# Altium schematic sheet PLWD_harvesting.SchDoc
size B; SheetNumber: 10; SheetTotal: 11
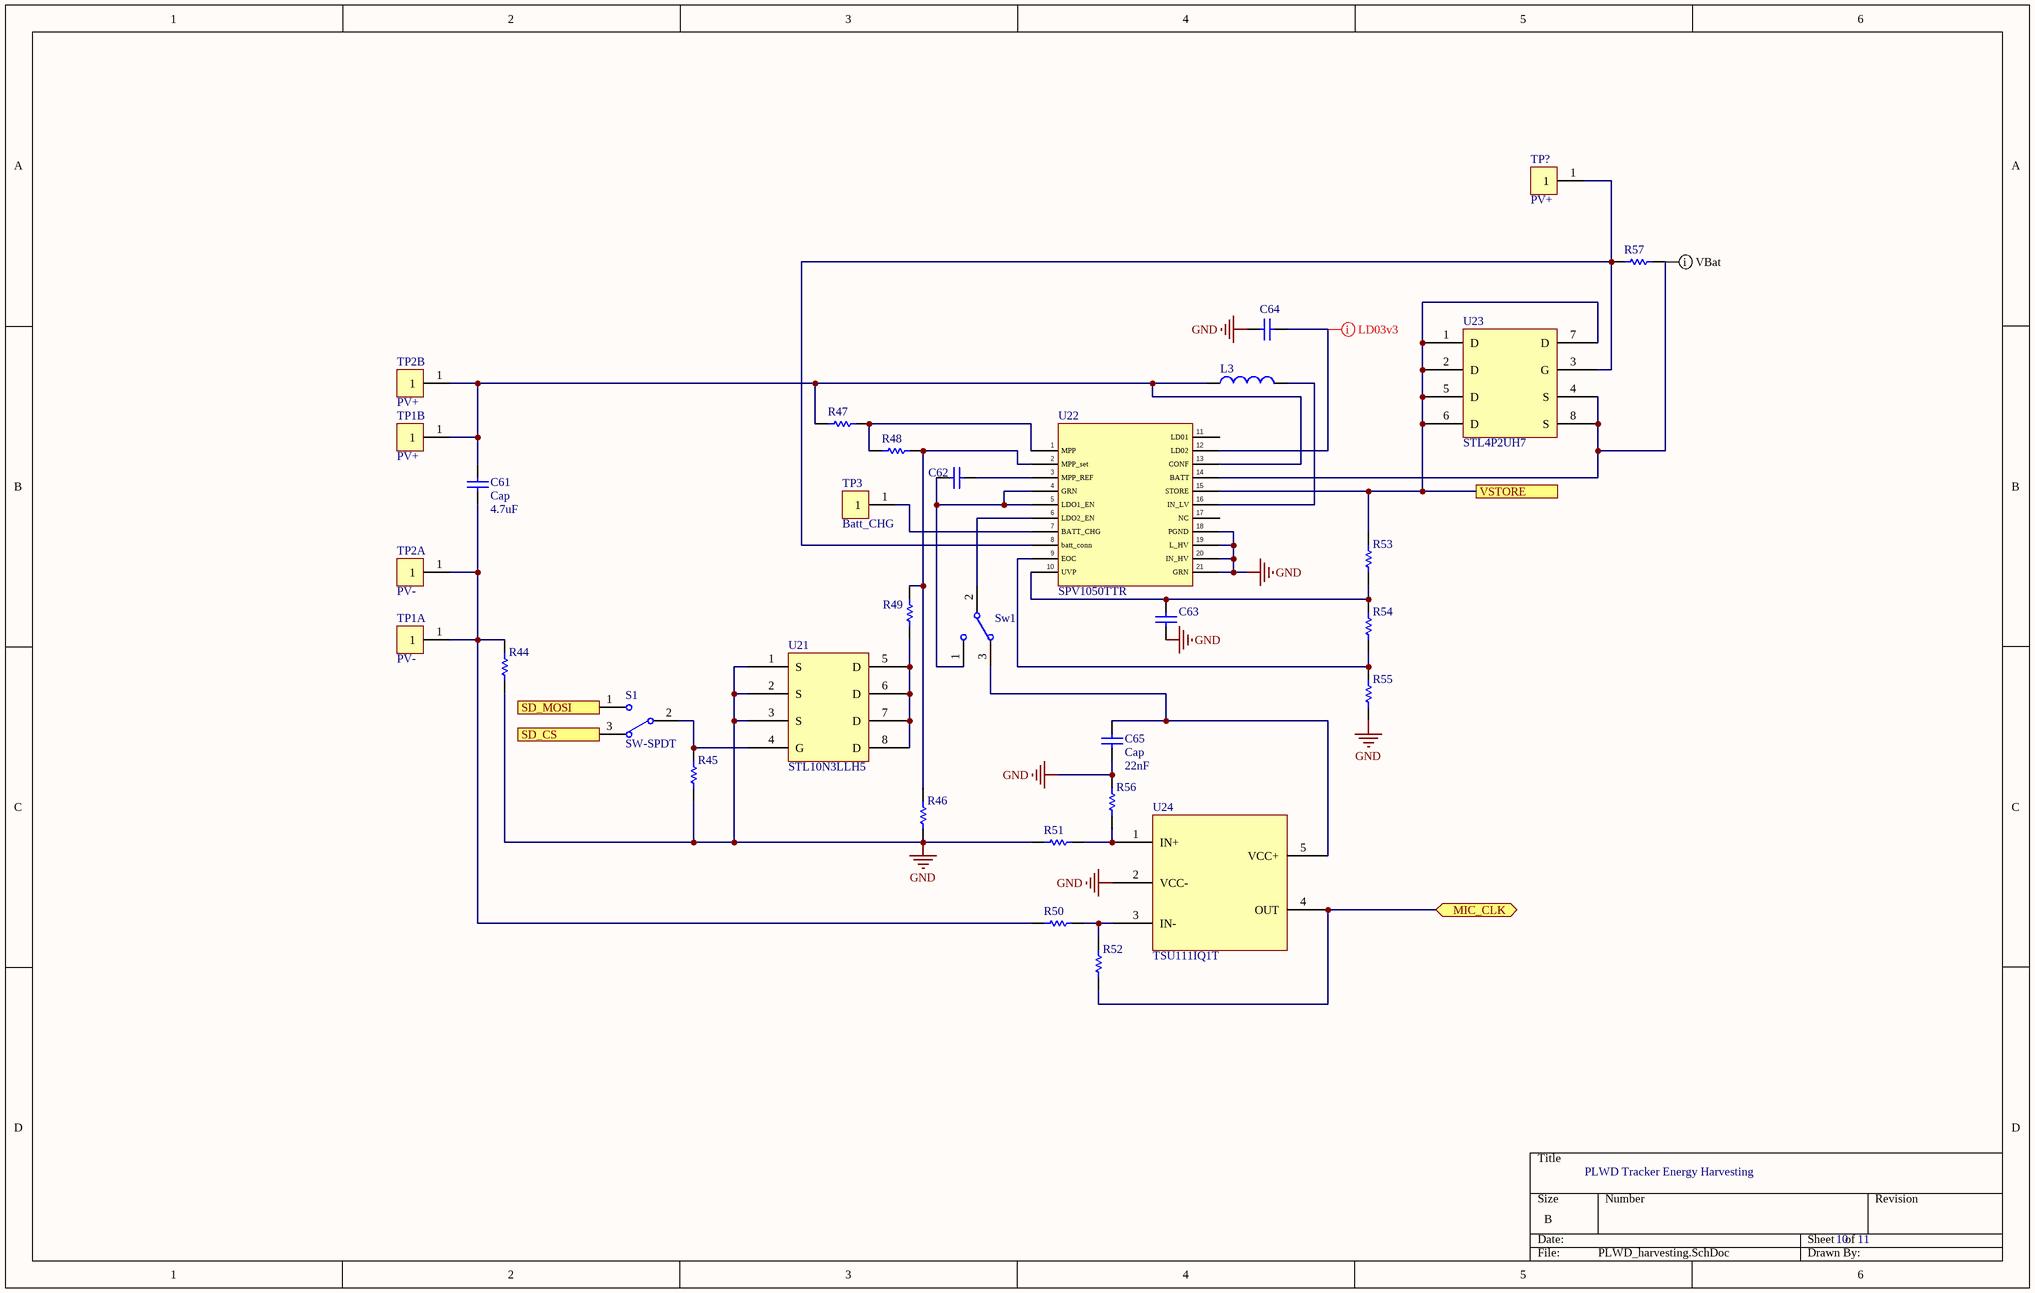
[diagram p0: PLWD_harvesting.SchDoc]

## Parts
C61  Cap  value 4.7uF  [RAD-0.3]
C62  Cap  [RAD-0.3]  (value not drawn)
C63  Cap  [RAD-0.3]  (value not drawn)
C64  Cap  [RAD-0.3]  (value not drawn)
C65  Cap  value 22nF  [RAD-0.3]
L3  Inductor  [0402-A]  (value not drawn)
R44  Res1  [AXIAL-0.3]  (value not drawn)
R45  Res1  [AXIAL-0.3]  (value not drawn)
R46  Res1  [AXIAL-0.3]  (value not drawn)
R47  Res1  [AXIAL-0.3]  (value not drawn)
R48  Res1  [AXIAL-0.3]  (value not drawn)
R49  Res1  [AXIAL-0.3]  (value not drawn)
R50  Res1  [AXIAL-0.3]  (value not drawn)
R51  Res1  [AXIAL-0.3]  (value not drawn)
R52  Res1  [AXIAL-0.3]  (value not drawn)
R53  Res1  [AXIAL-0.3]  (value not drawn)
R54  Res1  [AXIAL-0.3]  (value not drawn)
R55  Res1  [AXIAL-0.3]  (value not drawn)
R56  Res1  [AXIAL-0.3]  (value not drawn)
R57  Res1  [AXIAL-0.3]  (value not drawn)
S1  SW-SPDT  [TL36WW15050]
Sw1  SW-SPDT  [TL36WW15050]  (value not drawn)
TP1A  PV-
TP1B  PV+
TP2A  PV-
TP2B  PV+
TP3  Batt_CHG
TP?  PV+
U21  STL10N3LLH5
U22  SPV1050TTR
U23  STL4P2UH7
U24  TSU111IQ1T

## Ports
MIC_CLK (bidir), SD_CS (in), SD_MOSI (in), VSTORE

## Nets
GND: C63.2 C64.1 C65.1 R44.2 R45.2 R46.1 R51.1 R55.1 R56.2 U21.1(S) U21.2(S) U21.3(S) U22.18(PGND) U22.19(L_HV) U22.20(IN_HV) U22.21(GRN) U24.2(VCC-)
MIC_CLK: R52.1 U24.4(OUT) ; port MIC_CLK
SD_CS: S1.3 ; port SD_CS
SD_MOSI: S1.1 ; port SD_MOSI
VSTORE: R53.2 U22.15(STORE) U23.1(D) U23.2(D) U23.5(D) U23.6(D) U23.7(D) ; port VSTORE
NetC61_1: C61.1 R44.1 R50.1 TP1A.1 TP2A.1
NetC61_2: C61.2 L3.1 R47.1 TP1B.1 TP2B.1 U22.13(CONF)
NetC62_1: C62.1 U22.3(MPP_REF)
NetC62_2: C62.2 Sw1.1 U22.4(GRN) U22.5(LDO1_EN)
NetC63_1: C63.1 R53.1 R54.2 U22.10(UVP)
NetC64_2: C64.2 U22.12(LD02)
NetC65_2: C65.2 Sw1.3 U24.5(VCC+)
NetL3_2: L3.2 U22.16(IN_LV)
NetR45_1: R45.1 S1.2 U21.4(G)
NetR46_2: R46.2 R48.2 R49.2 U22.2(MPP_set)
NetR47_2: R47.2 R48.1 U22.1(MPP)
NetR49_1: R49.1 U21.5(D) U21.6(D) U21.7(D) U21.8(D)
NetR50_2: R50.2 R52.2 U24.3(IN-)
NetR51_2: R51.2 R56.1 U24.1(IN+)
NetR54_1: R54.1 R55.2 U22.9(EOC)
NetR57_1: R57.1 TP?.1 U22.8(batt_conn) U23.3(G)
NetR57_2: R57.2 U22.14(BATT) U23.4(S) U23.8(S)
NetSw1_2: Sw1.2 U22.6(LDO2_EN)
NetTP3_1: TP3.1 U22.7(BATT_CHG)

Not connected (* = marked no-connect by the designer): U22 11(LD01) 17(NC)

## Layout directives
mark named VBat: NetR57_2
mark named LD03v3: NetC64_2

## Notes on the sheet
- PLWD Tracker Energy Harvesting
- 10
- 11

## Library data of the parts
C61-C65 = Cap: Capacitor; Published: 8-Jun-2000; LatestRevisionDate: 17-Jul-2002; LatestRevisionNote: Re-released for DXP Platform.; PackageReference: RAD-0.3; Publisher: Altium Limited; PackageDescription: Radial Cap, Thru-Hole; 2 Leads; 0.3 in Pin Spacing
L3 = Inductor: Code_IEC: 1005; Value: 122uH; Published: 8-Jun-2000; LatestRevisionDate: 29-May-2009; LatestRevisionNote: IPC-7351 Footprint Added.; PackageReference: 0402-A; Publisher: Altium Limited; PackageDescription: Chip Inductor; Code_JEITA: 0402
R44 R45 R47 = Res1: Resistor; Value: 261; Published: 8-Jun-2000; LatestRevisionDate: 17-Jul-2002; LatestRevisionNote: Re-released for DXP Platform.; PackageReference: AXIAL-0.3; Publisher: Altium Limited; PackageDescription: Axial Device, Thru-Hole; 2 Leads; 0.3 in Pin Spacing
R46 R49 R51 R53-R55 R57 = Res1: Resistor; Value: 283.3k; Published: 8-Jun-2000; LatestRevisionDate: 17-Jul-2002; LatestRevisionNote: Re-released for DXP Platform.; PackageReference: AXIAL-0.3; Publisher: Altium Limited; PackageDescription: Axial Device, Thru-Hole; 2 Leads; 0.3 in Pin Spacing
R48 = Res1: Resistor; Value: 120; Published: 8-Jun-2000; LatestRevisionDate: 17-Jul-2002; LatestRevisionNote: Re-released for DXP Platform.; PackageReference: AXIAL-0.3; Publisher: Altium Limited; PackageDescription: Axial Device, Thru-Hole; 2 Leads; 0.3 in Pin Spacing
R50 R52 = Res1: Resistor; Value: 273.3k; Published: 8-Jun-2000; LatestRevisionDate: 17-Jul-2002; LatestRevisionNote: Re-released for DXP Platform.; PackageReference: AXIAL-0.3; Publisher: Altium Limited; PackageDescription: Axial Device, Thru-Hole; 2 Leads; 0.3 in Pin Spacing
R56 = Res1: Resistor; Value: 330k; Published: 8-Jun-2000; LatestRevisionDate: 17-Jul-2002; LatestRevisionNote: Re-released for DXP Platform.; PackageReference: AXIAL-0.3; Publisher: Altium Limited; PackageDescription: Axial Device, Thru-Hole; 2 Leads; 0.3 in Pin Spacing
S1 Sw1 = SW-SPDT: SPDT Subminiature Toggle Switch, Right Angle Mounting, Vertical Actuation; Published: 24-Mar-1999; LatestRevisionDate: 17-Dec-2003; LatestRevisionNote: Schematic revised, PCB Footprint replaced.; DatasheetVersion: 05-Dec-2000; PackageReference: TL36WW15050; Publisher: Altium Limited; PackageDescription: Switch; 4 Leads; ComponentLink1Description: Manufacturer Link; ComponentLink1URL: http://www.apem.com
TP1A TP2A = PV- Connector
TP1B TP2B TP3 TP? = PV Connector
U21 = STL10N3LLH5: N-channel 30 V, 0.015 Ohm, 9 A, PowerFLAT(TM) 3.3x3.3 STripFET(TM) V Power MOSFET; Manufacturer: STMicroelectronics; Rise Time: 4.2ns; Rds On Max: 19mR; Input Capacitance: 900pF; Continuous Drain Current (ID): 9A; Drain to Source Breakdown Voltage: 30V; Power Dissipation: 50W; Turn-Off Delay Time: 21ns; Fall Time: 3.5ns; Gate to Source Voltage (Vgs): 22V; Turn-On Delay Time: 4ns; Element Configuration: Single; Nominal Vgs: 1V; On-State Resistance: 11.7R; Supplier 1: Mouser; Manufacturer Part Number: STL10N3LLH5; RoHS: Yes; Category: MOSFETs; Stock 1: 399; Pricing 1: 1=0.91000, 10=0.81400, 50=0.81400, 100=0.63500, 1000=0.41400, 10000=0.40100 (USD); Mount: Surface Mount; Number of Pins: 8; Min Operating Temperature: -55°C; Max Operating Temperature: 150°C; Packaging: Tape and Reel; Package Quantity: 1; Drain to Source Resistance: 19mR; Drain to Source Voltage (Vdss): 30V; Max Power Dissipation: 50W; Polarity: N-CHANNEL; Series: STripFET™ V; Threshold Voltage: 1V; Drain-source On Resistance-Max: 11.7R; Radiation Hardening: No; RoHS Compliant: Yes; REACH SVHC: No SVHC; Lead Free: Lead Free; ComponentLink1URL: https://datasheet.ciiva.com/4440/dm00035877-100296-4440615.pdf?src-supplier=Mouser; ComponentLink1Description: https://datasheet.ciiva.com/4440/dm00035877-100296-4440615.pdf?src-supplier=Mouser; ComponentLink2URL: https://datasheet.ciiva.com/16217/dm00035877-16217685.pdf?src-supplier=Future+Electronics; ComponentLink2Description: https://datasheet.ciiva.com/16217/dm00035877-16217685.pdf?src-supplier=Future+Electronics; ComponentLink3URL: https://datasheet.ciiva.com/22692/1722909-22692225.pdf?src-supplier=Element14; ComponentLink3Description: https://datasheet.ciiva.com/22692/1722909-22692225.pdf?src-supplier=Element14; ComponentLink4URL: https://datasheet.ciiva.com/938/dm00035877-938683.pdf?src-supplier=Digi-Key; ComponentLink4Description: https://datasheet.ciiva.com/938/dm00035877-938683.pdf?src-supplier=Digi-Key; ComponentLink5URL: https://datasheet.ciiva.com/6368/dm00035877-6368525.pdf?src-supplier=Digi-Key; ComponentLink5Description: https://datasheet.ciiva.com/6368/dm00035877-6368525.pdf?src-supplier=Digi-Key
U22 = SPV1050TTR: Ultra low power energy harvester and battery charger with embedded MPPT and LDOs; Manufacturer: STMicroelectronics; Max Supply Voltage: 18V; Max Charge Current: 70mA; Battery Pack Voltage: 5.3V; Supplier 1: Digi-Key; Manufacturer Part Number: SPV1050TTR; RoHS: Yes; Category: Battery Management; Pricing 1: 1=3.91000, 10=3.51000, 25=3.31880, 100=2.87620, 250=2.72872, 500=2.44848, 1000=2.43512 (USD); Number of Pins: 20; Min Operating Temperature: -40°C; Max Operating Temperature: 85°C; Packaging: Tape and Reel; RoHS Compliant: Yes; ComponentLink1URL: http://www.farnell.com/datasheets/2291180.pdf?src-supplier=Farnell; ComponentLink1Description: http://www.farnell.com/datasheets/2291180.pdf?src-supplier=Farnell; ComponentLink2URL: http://www.mouser.com/ds/2/389/spv1050-974147.pdf?src-supplier=Mouser; ComponentLink2Description: http://www.mouser.com/ds/2/389/spv1050-974147.pdf?src-supplier=Mouser; ComponentLink3URL: http://www.st.com/content/ccc/resource/technical/document/datasheet/3e/91/0f/7c/32/3e/46/dd/DM00100984.pdf/files/DM00100984.pdf/jcr:content/translations/en.DM00100984.pdf?src-supplier=Digi-Key; ComponentLink3Description: http://www.st.com/content/ccc/resource/technical/document/datasheet/3e/91/0f/7c/32/3e/46/dd/DM00100984.pdf/files/DM00100984.pdf/jcr:content/translations/en.DM00100984.pdf?src-supplier=Digi-Key; ComponentLink4URL: http://www.st.com/web/en/resource/technical/document/datasheet/DM00100984.pdf?src-supplier=Avnet; ComponentLink4Description: http://www.st.com/web/en/resource/technical/document/datasheet/DM00100984.pdf?src-supplier=Avnet; ComponentLink5URL: http://www.farnell.com/datasheets/2291180.pdf?src-supplier=Newark; ComponentLink5Description: http://www.farnell.com/datasheets/2291180.pdf?src-supplier=Newark; Supplier Part Number 1: 497-15978-1-ND
U23 = STL4P2UH7: P-channel 20 V, 0.087 Ohm typ., 4 A STripFET H7 Power MOSFET in a PowerFLAT 2x2 package; Manufacturer: STMicroelectronics; Drain to Source Voltage (Vdss): 20V; Continuous Drain Current (ID): 4A; Rds On Max: 100mR; Input Capacitance: 510pF; Max Power Dissipation: 2.4W; Number of Elements: 1; Gate to Source Voltage (Vgs): 8V; Element Configuration: Single; Fall Time: 19ns; Rise Time: 21ns; Turn-Off Delay Time: 40ns; Turn-On Delay Time: 9ns; Supplier 1: Digi-Key; Manufacturer Part Number: STL4P2UH7; RoHS: Yes; Category: MOSFETs; Stock 1: 4; Pricing 1: 1=0.46000 (USD); Mount: Surface Mount; Number of Pins: 6; Min Operating Temperature: -55°C; Max Operating Temperature: 150°C; Packaging: Tape and Reel; Power Dissipation: 2.4W; Number of Channels: 1; Drain to Source Breakdown Voltage: 20V; Drain to Source Resistance: 100mR; Package Quantity: 3000; Lead Free: Lead Free; ComponentLink1URL: http://components.arrow.com/part/dataview/66338135S1070583N9185?src-supplier=Arrow+Electronics; ComponentLink1Description: http://components.arrow.com/part/dataview/66338135S1070583N9185?src-supplier=Arrow+Electronics; ComponentLink2URL: http://www.mouser.com/ds/2/389/stl4p2uh7-956091.pdf?src-supplier=Mouser; ComponentLink2Description: http://www.mouser.com/ds/2/389/stl4p2uh7-956091.pdf?src-supplier=Mouser; ComponentLink3URL: http://www.st.com/content/ccc/resource/technical/document/datasheet/group3/56/f4/8b/71/b1/01/42/91/DM00091043/files/DM00091043.pdf/jcr:content/translations/en.DM00091043.pdf?src-supplier=Digi-Key; ComponentLink3Description: http://www.st.com/content/ccc/resource/technical/document/datasheet/group3/56/f4/8b/71/b1/01/42/91/DM00091043/files/DM00091043.pdf/jcr:content/translations/en.DM00091043.pdf?src-supplier=Digi-Key; ComponentLink4URL: http://www.st.com/st-web-ui/static/active/en/resource/technical/document/datasheet/DM00091043.pdf?src-supplier=Avnet; ComponentLink4Description: http://www.st.com/st-web-ui/static/active/en/resource/technical/document/datasheet/DM00091043.pdf?src-supplier=Avnet
U24 = TSU111IQ1T: Nanopower (900 nA) high accuracy (150 uV) 5V CMOS Op-Amp, -40 to 85°C, MLPD-6, Tape and Reel; Manufacturer: STMicroelectronics; Number of Circuits: 1; Slew Rate: 0.0027V/µs; Gain Bandwidth Product: 11.5kHz; Input Bias Current: 10pA; Input Offset Voltage (Vos): 150uV; Operating Supply Current: 950nA; Output Current per Channel: 45mA; Supplier 1: Digi-Key; Manufacturer Part Number: TSU111IQ1T; RoHS: Yes; Category: Amplifiers - Op Amps, Buffer, Instrumentation; Stock 1: 1685; Pricing 1: 1=1.91000, 10=1.71600, 25=1.61880, 100=1.37930, 250=1.29512, 500=1.13322, 1000=1.06908 (USD); Mount: Surface Mount; Case/Package: DFN; Number of Pins: 6; Min Operating Temperature: -40°C; Max Operating Temperature: 85°C; Packaging: Cut Tape; RoHS Compliant: Yes; ComponentLink1URL: http://www.st.com/content/ccc/resource/technical/document/datasheet/group3/30/c9/50/18/06/1a/44/8d/DM00329336/files/DM00329336.pdf/jcr:content/translations/en.DM00329336.pdf?src-supplier=Digi-Key; ComponentLink1Description: http://www.st.com/content/ccc/resource/technical/document/datasheet/group3/30/c9/50/18/06/1a/44/8d/DM00329336/files/DM00329336.pdf/jcr:content/translations/en.DM00329336.pdf?src-supplier=Digi-Key